# EAGLE design Drone (EAGLE 9.6.2)

## Sheet 1 of 3
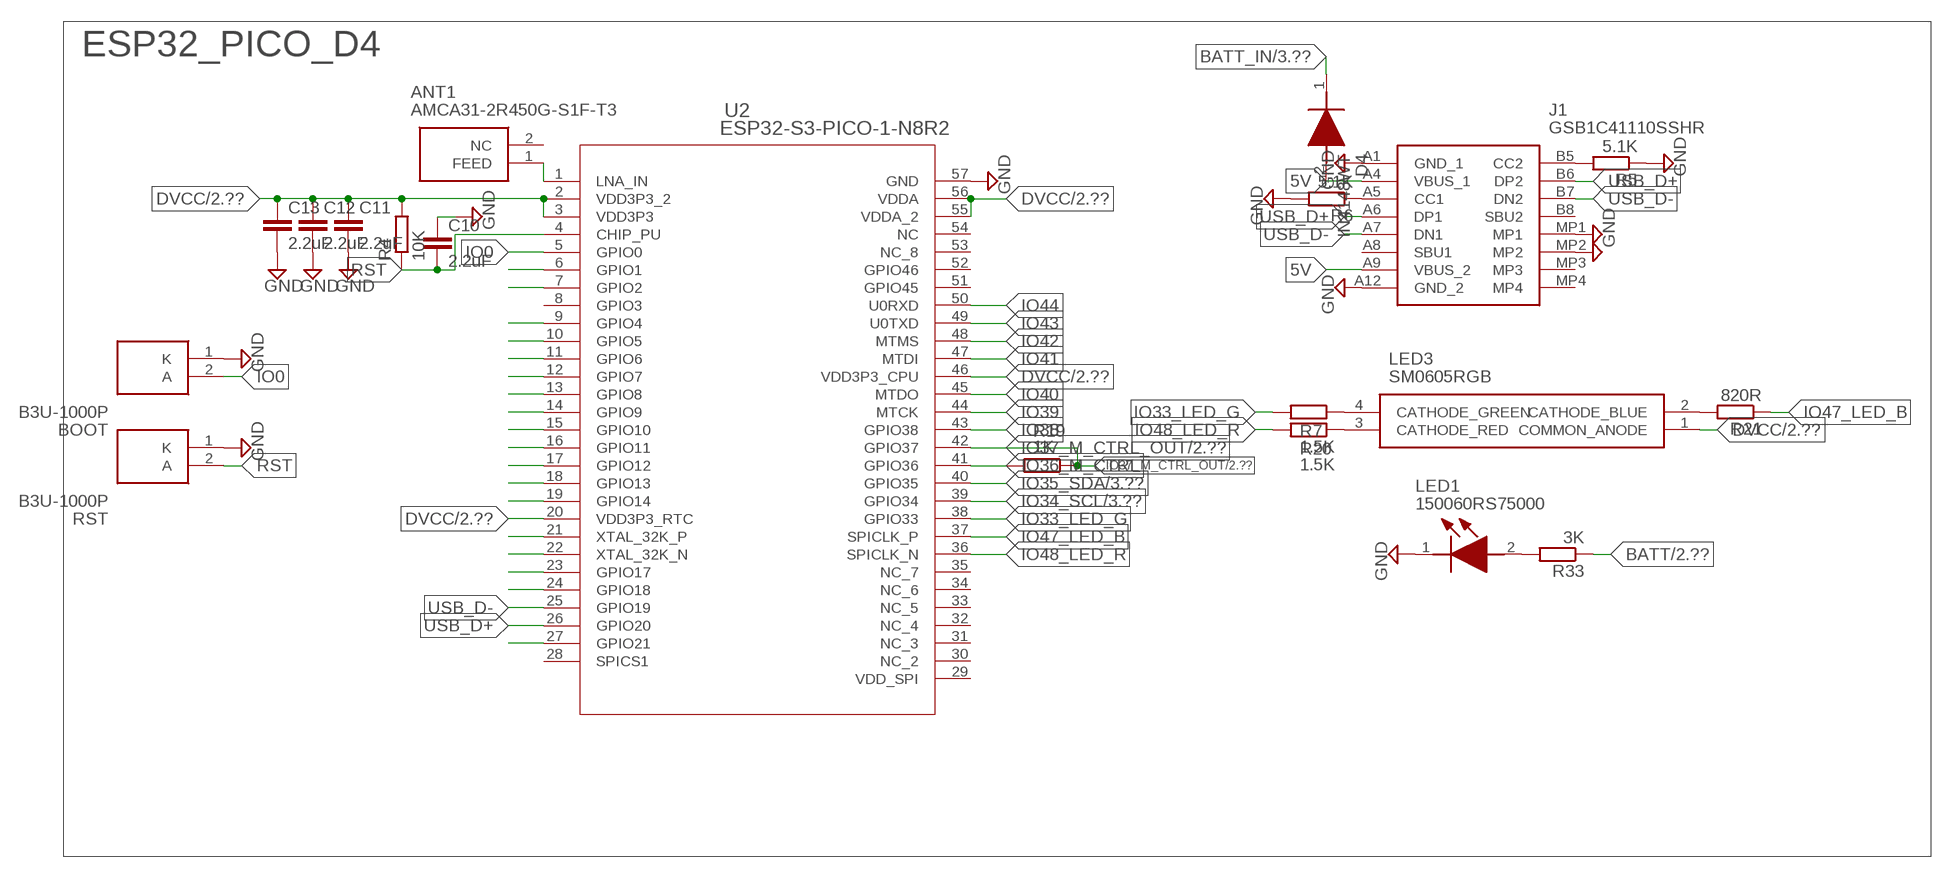
[diagram p0: schematic, sheet 1]

### Parts
ANT1  AMCA31-2R450G-S1F-T3  [ANTC3216X140N]
BOOT  B3U-1000P  [B3U-1000P]
C10  2.2uF  C0402_STANDARD  [C0402_STANDARD]
C11  2.2uF  C0402_STANDARD  [C0402_STANDARD]
C12  2.2uF  C0402_STANDARD  [C0402_STANDARD]
C13  2.2uF  C0402_STANDARD  [C0402_STANDARD]
D4  IN4148WT  [SODFL1608X70N]
J1  GSB1C41110SSHR  [GSB1C41110SSHR]
LED1  150060RS75000  [LEDC1608X80N]
LED3  SM0605RGB  [SM0605RGB]
R4  10K  R0402_STANDARD  [R0402_STANDARD]
R5  5.1K  R0402_STANDARD  [R0402_STANDARD]
R6  5.1K  R0402_STANDARD  [R0402_STANDARD]
R7  1.5K  R0402_STANDARD  [R0402_STANDARD]
R19  1K  R0402_STANDARD  [R0402_STANDARD]
R20  1.5K  R0402_STANDARD  [R0402_STANDARD]
R21  820R  R0402_STANDARD  [R0402_STANDARD]
R33  3K  R0402_STANDARD  [R0402_STANDARD]
RST  B3U-1000P  [B3U-1000P]
U2  ESP32-S3-PICO-1-N8R2  [QFN56_7X7_EXP]

### Nets
5V: D4.2(A) J1.A4(VBUS_1) J1.A9(VBUS_2)
BATT: R33.1 ; also sheet 2,3
BATT_IN: D4.1(K) ; also sheet 3
DVCC: C11.1 C12.1 C13.1 LED3.1(COMMON_ANODE) R4.2 U2.2(VDD3P3_2) U2.3(VDD3P3) U2.20(VDD3P3_RTC) U2.46(VDD3P3_CPU) U2.55(VDDA_2) U2.56(VDDA) ; also sheet 2,3
GND: BOOT.1(K) C10.1 C11.2 C12.2 C13.2 J1.A1(GND_1) J1.A12(GND_2) J1.MP1 J1.MP2 LED1.1(K) R5.1 R6.2 RST.1(K) U2.57(GND) ; also sheet 2,3
IO0: BOOT.2(A) U2.5(GPIO0)
IO33_LED_G: R7.2 U2.38(GPIO33)
IO34_SCL: U2.39(GPIO34) ; also sheet 3
IO35_SDA: U2.40(GPIO35) ; also sheet 3
IO36_M_CTRL: R19.2 U2.41(GPIO36)
IO37_M_CTRL_OUT: R19.1 U2.42(GPIO37) ; also sheet 2
IO38: U2.43(GPIO38)
IO39: U2.44(MTCK)
IO40: U2.45(MTDO)
IO41: U2.47(MTDI)
IO42: U2.48(MTMS)
IO43: U2.49(U0TXD)
IO44: U2.50(U0RXD)
IO47_LED_B: R21.1 U2.37(SPICLK_P)
IO48_LED_R: R20.2 U2.36(SPICLK_N)
N$1: ANT1.1(FEED) U2.1(LNA_IN)
N$4: LED3.4(CATHODE_GREEN) R7.1
N$7: U2.6(GPIO1)
N$8: U2.7(GPIO2)
N$10: U2.9(GPIO4)
N$11: U2.10(GPIO5)
N$12: U2.11(GPIO6)
N$13: U2.12(GPIO7)
N$14: U2.13(GPIO8)
N$15: U2.14(GPIO9)
N$16: U2.15(GPIO10)
N$17: U2.16(GPIO11)
N$18: U2.17(GPIO12)
N$19: U2.18(GPIO13)
N$20: U2.19(GPIO14)
N$21: J1.A5(CC1) R6.1
N$22: U2.21(XTAL_32K_P)
N$23: U2.22(XTAL_32K_N)
N$24: U2.23(GPIO17)
N$25: U2.24(GPIO18)
N$27: LED1.2(A) R33.2
N$28: U2.27(GPIO21)
N$29: LED3.2(CATHODE_BLUE) R21.2
N$32: J1.B5(CC2) R5.2
N$37: LED3.3(CATHODE_RED) R20.1
RST: C10.2 R4.1 RST.2(A) U2.4(CHIP_PU)
USB_D+: J1.A6(DP1) J1.B6(DP2) U2.26(GPIO20)
USB_D-: J1.A7(DN1) J1.B7(DN2) U2.25(GPIO19)
Unconnected: ANT1.2(NC) J1.A8(SBU1) J1.B8(SBU2) J1.MP3 J1.MP4 U2.8(GPIO3) U2.28(SPICS1) U2.30(NC_2) U2.31(NC_3) U2.32(NC_4) U2.33(NC_5) U2.34(NC_6) U2.35(NC_7) U2.51(GPIO45) U2.52(GPIO46) U2.53(NC_8) U2.54(NC)

### Notes on the sheet
- ESP32_PICO_D4

## Sheet 2 of 3
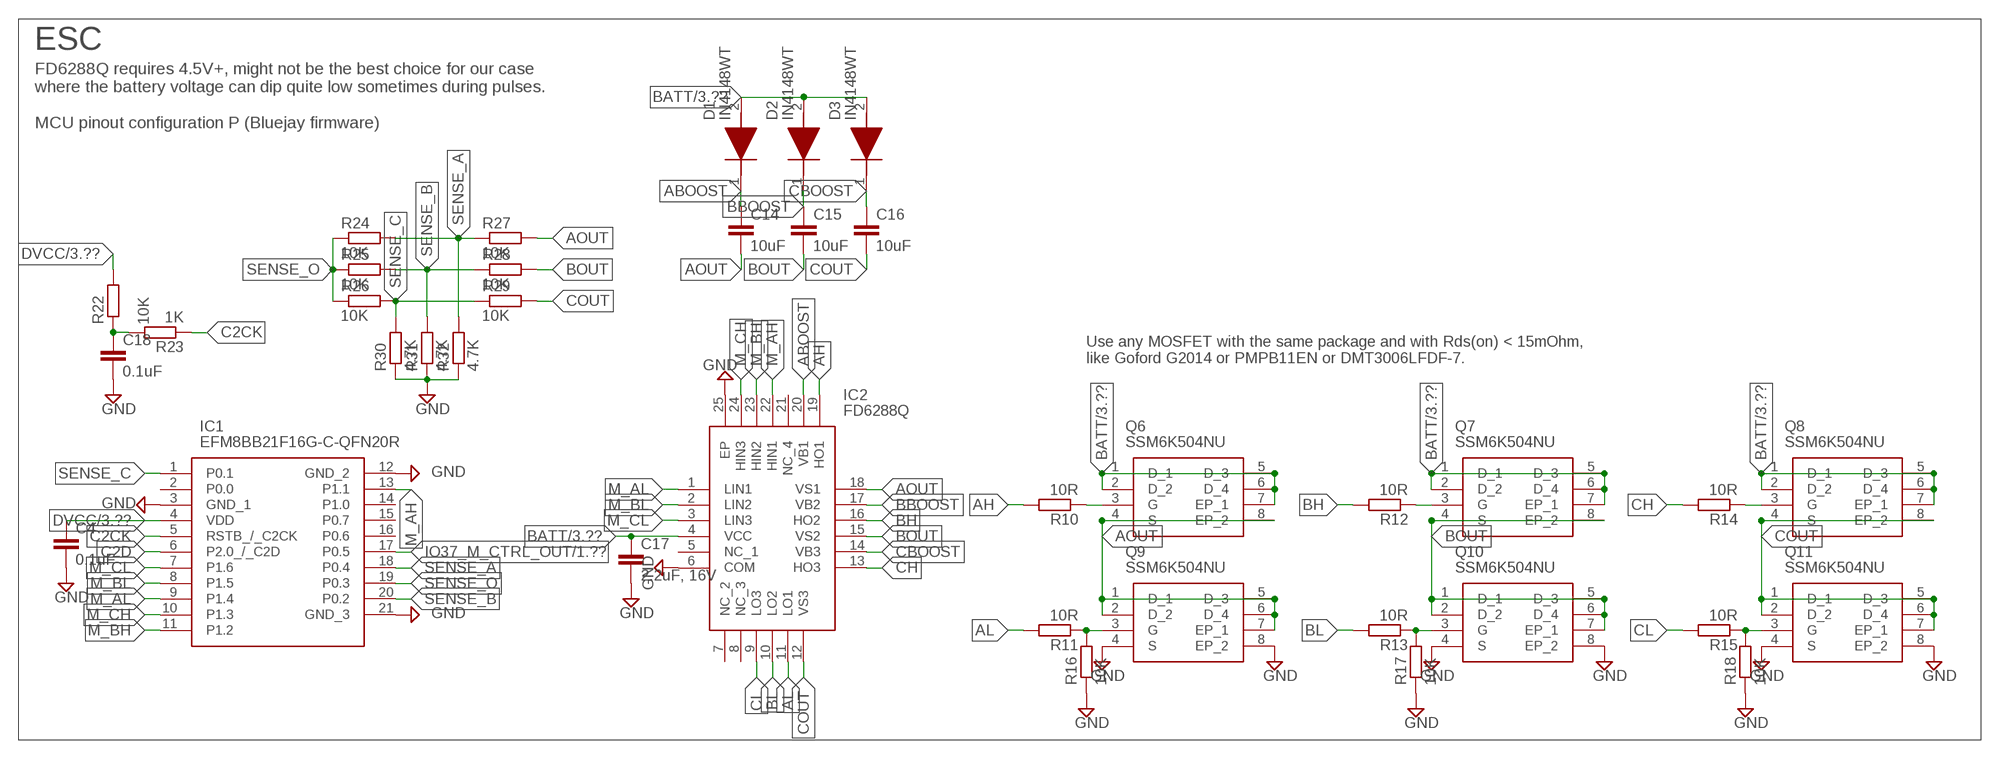
[diagram p1: schematic, sheet 2]

### Parts
C4  0.1uF  C0402_STANDARD  [C0402_STANDARD]
C14  10uF  C0402_STANDARD  [C0402_STANDARD]
C15  10uF  C0402_STANDARD  [C0402_STANDARD]
C16  10uF  C0402_STANDARD  [C0402_STANDARD]
C17  2.2uF, 16V  C0402_STANDARD  [C0402_STANDARD]
C18  0.1uF  C0402_STANDARD  [C0402_STANDARD]
D1  IN4148WT  [SODFL1608X70N]
D2  IN4148WT  [SODFL1608X70N]
D3  IN4148WT  [SODFL1608X70N]
IC1  EFM8BB21F16G-C-QFN20R  [EFM8BB21F16GCQFN20R]
IC2  FD6288Q  [QFN50P400X400X90-25N]
Q6  SSM6K504NU  [SSM6K504NU]
Q7  SSM6K504NU  [SSM6K504NU]
Q8  SSM6K504NU  [SSM6K504NU]
Q9  SSM6K504NU  [SSM6K504NU]
Q10  SSM6K504NU  [SSM6K504NU]
Q11  SSM6K504NU  [SSM6K504NU]
R10  10R  R0402_STANDARD  [R0402_STANDARD]
R11  10R  R0402_STANDARD  [R0402_STANDARD]
R12  10R  R0402_STANDARD  [R0402_STANDARD]
R13  10R  R0402_STANDARD  [R0402_STANDARD]
R14  10R  R0402_STANDARD  [R0402_STANDARD]
R15  10R  R0402_STANDARD  [R0402_STANDARD]
R16  10K  R0402_STANDARD  [R0402_STANDARD]
R17  10K  R0402_STANDARD  [R0402_STANDARD]
R18  10K  R0402_STANDARD  [R0402_STANDARD]
R22  10K  R0402_STANDARD  [R0402_STANDARD]
R23  1K  R0402_STANDARD  [R0402_STANDARD]
R24  10K  R0402_STANDARD  [R0402_STANDARD]
R25  10K  R0402_STANDARD  [R0402_STANDARD]
R26  10K  R0402_STANDARD  [R0402_STANDARD]
R27  10K  R0402_STANDARD  [R0402_STANDARD]
R28  10K  R0402_STANDARD  [R0402_STANDARD]
R29  10K  R0402_STANDARD  [R0402_STANDARD]
R30  4.7K  R0402_STANDARD  [R0402_STANDARD]
R31  4.7K  R0402_STANDARD  [R0402_STANDARD]
R32  4.7K  R0402_STANDARD  [R0402_STANDARD]

### Nets
ABOOST: C14.1 D1.1(K) IC2.20(VB1)
AH: IC2.19(HO1) R10.2
AL: IC2.11(LO1) R11.2
AOUT: C14.2 IC2.18(VS1) Q6.4(S) Q6.8(EP_2) Q9.1(D_1) Q9.2(D_2) Q9.5(D_3) Q9.6(D_4) Q9.7(EP_1) R27.2
BATT: C17.1 D1.2(A) D2.2(A) D3.2(A) IC2.4(VCC) Q6.1(D_1) Q6.2(D_2) Q6.5(D_3) Q6.6(D_4) Q6.7(EP_1) Q7.1(D_1) Q7.2(D_2) Q7.5(D_3) Q7.6(D_4) Q7.7(EP_1) Q8.1(D_1) Q8.2(D_2) Q8.5(D_3) Q8.6(D_4) Q8.7(EP_1) ; also sheet 1,3
BBOOST: C15.1 D2.1(K) IC2.17(VB2)
BH: IC2.16(HO2) R12.2
BL: IC2.10(LO2) R13.2
BOUT: C15.2 IC2.15(VS2) Q7.4(S) Q7.8(EP_2) Q10.1(D_1) Q10.2(D_2) Q10.5(D_3) Q10.6(D_4) Q10.7(EP_1) R28.2
C2CK: IC1.5(RSTB_/_C2CK) R23.1
C2D: IC1.6(P2.0_/_C2D)
CBOOST: C16.1 D3.1(K) IC2.14(VB3)
CH: IC2.13(HO3) R14.2
CL: IC2.9(LO3) R15.2
COUT: C16.2 IC2.12(VS3) Q8.4(S) Q8.8(EP_2) Q11.1(D_1) Q11.2(D_2) Q11.5(D_3) Q11.6(D_4) Q11.7(EP_1) R29.2
DVCC: C4.1 IC1.4(VDD) R22.2 ; also sheet 1,3
GND: C4.2 C17.2 C18.2 IC1.3(GND_1) IC1.12(GND_2) IC1.21(GND_3) IC2.6(COM) IC2.25(EP) Q9.4(S) Q9.8(EP_2) Q10.4(S) Q10.8(EP_2) Q11.4(S) Q11.8(EP_2) R16.1 R17.1 R18.1 R30.1 R31.1 R32.1 ; also sheet 1,3
IO37_M_CTRL_OUT: IC1.17(P0.5) ; also sheet 1
M_AH: IC1.13(P1.1) IC2.22(HIN1)
M_AL: IC1.9(P1.4) IC2.1(LIN1)
M_BH: IC1.11(P1.2) IC2.23(HIN2)
M_BL: IC1.8(P1.5) IC2.2(LIN2)
M_CH: IC1.10(P1.3) IC2.24(HIN3)
M_CL: IC1.7(P1.6) IC2.3(LIN3)
N$31: Q6.3(G) R10.1
N$33: Q9.3(G) R11.1 R16.2
N$34: Q7.3(G) R12.1
N$35: Q10.3(G) R13.1 R17.2
N$36: Q8.3(G) R14.1
N$38: Q11.3(G) R15.1 R18.2
N$55: C18.1 R22.1 R23.2
SENSE_A: IC1.18(P0.4) R24.2 R27.1 R32.2
SENSE_B: IC1.20(P0.2) R25.2 R28.1 R31.2
SENSE_C: IC1.1(P0.1) R26.2 R29.1 R30.2
SENSE_O: IC1.19(P0.3) R24.1 R25.1 R26.1
Unconnected: IC1.2(P0.0) IC1.14(P1.0) IC1.15(P0.7) IC1.16(P0.6) IC2.5(NC_1) IC2.7(NC_2) IC2.8(NC_3) IC2.21(NC_4)

### Notes on the sheet
- ESC
- FD6288Q requires 4.5V+, might not be the best choice for our case
  where the battery voltage can dip quite low sometimes during pulses. 
  
  MCU pinout configuration P (Bluejay firmware)
- Use any MOSFET with the same package and with Rds(on) < 15mOhm,
  like Goford G2014 or PMPB11EN or DMT3006LFDF-7.

## Sheet 3 of 3
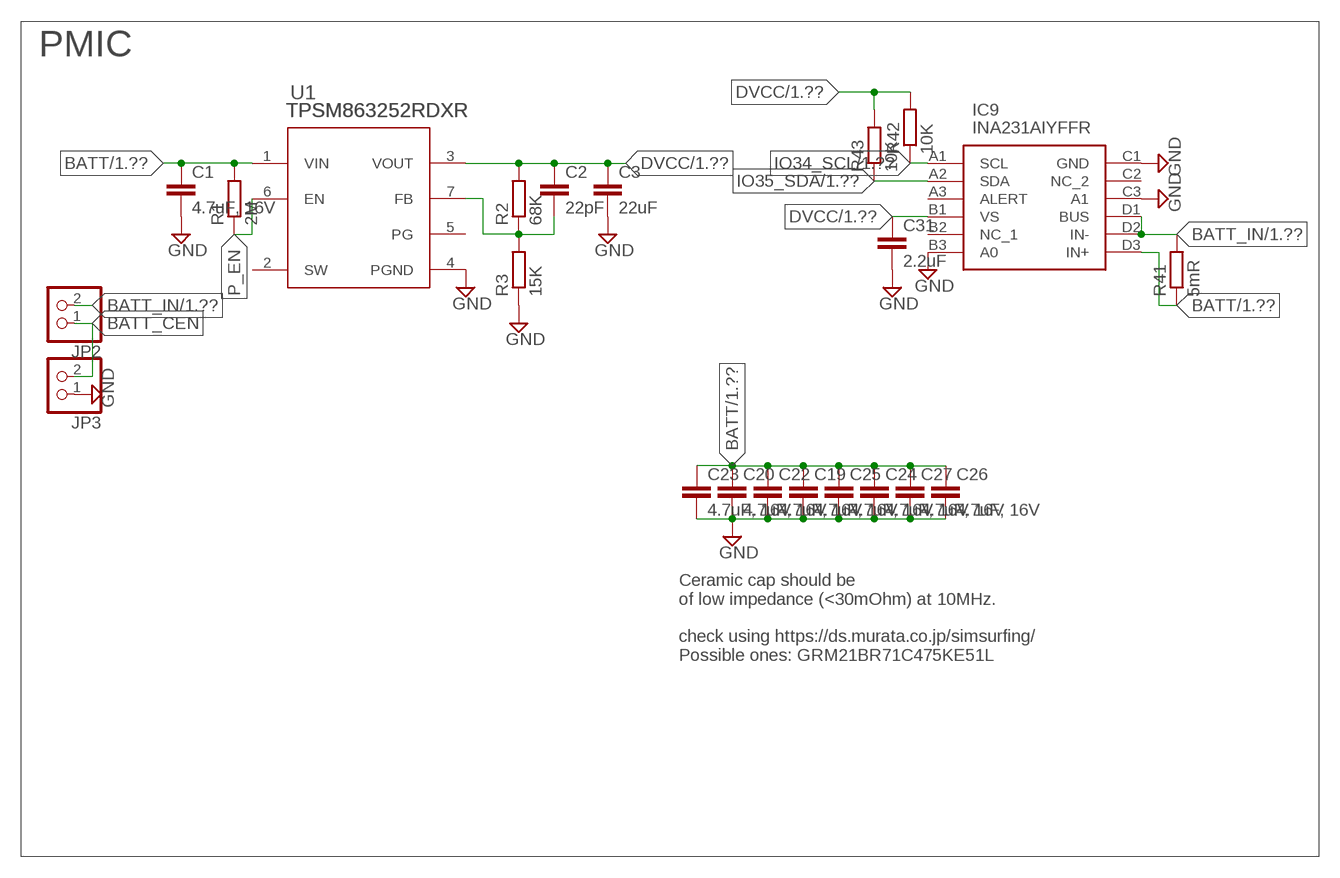
[diagram p2: schematic, sheet 3]

### Parts
C1  4.7uF, 16V  C-EUC0603  [C0603]
C2  22pF  C0402_STANDARD  [C0402_STANDARD]
C3  22uF  C-EUC0603  [C0603]
C19  4.7uF, 16V  C-EUC0805  [C0805]
C20  4.7uF, 16V  C-EUC0805  [C0805]
C22  4.7uF, 16V  C-EUC0805  [C0805]
C23  4.7uF, 16V  C-EUC0805  [C0805]
C24  4.7uF, 16V  C-EUC0805  [C0805]
C25  4.7uF, 16V  C-EUC0805  [C0805]
C26  4.7uF, 16V  C-EUC0805  [C0805]
C27  4.7uF, 16V  C-EUC0805  [C0805]
C31  2.2uF  C0402_STANDARD  [C0402_STANDARD]
IC9  INA231AIYFFR  [BGA12C40P3X4_139X164X62]
JP2  PINHD-1X2  [1X02]
JP3  PINHD-1X2  [1X02]
R1  2M  R0402_STANDARD  [R0402_STANDARD]
R2  68K  R0402_STANDARD  [R0402_STANDARD]
R3  15K  R0402_STANDARD  [R0402_STANDARD]
R41  5mR  R-EU_R0805  [R0805]
R42  10K  R0402_STANDARD  [R0402_STANDARD]
R43  10K  R0402_STANDARD  [R0402_STANDARD]
U1  TPSM863252RDXR  [RDX0007A-MFG]

### Nets
BATT: C1.1 C19.1 C20.1 C22.1 C23.1 C24.1 C25.1 C26.1 C27.1 IC9.D3(IN+) R1.2 R41.1 U1.1(VIN) ; also sheet 1,2
BATT_CEN: JP2.1 JP3.2
BATT_IN: IC9.D1(BUS) IC9.D2(IN-) JP2.2 R41.2 ; also sheet 1
DVCC: C2.1 C3.1 C31.1 IC9.B1(VS) R2.2 R42.2 R43.2 U1.3(VOUT) ; also sheet 1,2
GND: C1.2 C3.2 C19.2 C20.2 C22.2 C23.2 C24.2 C25.2 C26.2 C27.2 C31.2 IC9.B3(A0) IC9.C1(GND) IC9.C3(A1) JP3.1 R3.1 U1.4(PGND) ; also sheet 1,2
IO34_SCL: IC9.A1(SCL) R42.1 ; also sheet 1
IO35_SDA: IC9.A2(SDA) R43.1 ; also sheet 1
N$2: C2.2 R2.1 R3.2 U1.7(FB)
P_EN: R1.1 U1.6(EN)
Unconnected: IC9.A3(ALERT) IC9.B2(NC_1) IC9.C2(NC_2) U1.2(SW) U1.5(PG)

### Notes on the sheet
- PMIC
- Ceramic cap should be
  of low impedance (<30mOhm) at 10MHz.
  
  check using https://ds.murata.co.jp/simsurfing/
  Possible ones: GRM21BR71C475KE51L

## Power pins joined to a net without a drawn wire
VDD_SPI: U2.29(VDD_SPI)

## Library data of the parts
ANT1 = SamacSys_Parts:AMCA31-2R450G-S1F-T3: ABRACON - AMCA31-2R450G-S1F-T3 - ANTENNA, CHIP, 2.45GHZ, 50 OHM, 1206 Source: Datasheet <http://www.abracon.com/chip-antenna/AMCA31-2R450G-S1F-T.pdf>; ARROW_PART_NUMBER: AMCA31-2R450G-S1F-T3; ARROW_PRICE-STOCK: https://www.arrow.com/en/products/amca31-2r450g-s1f-t3/abracon?region=nac; DESCRIPTION: ABRACON - AMCA31-2R450G-S1F-T3 - ANTENNA, CHIP, 2.45GHZ, 50 OHM, 1206; HEIGHT: 1.4mm; MANUFACTURER_NAME: ABRACON; MANUFACTURER_PART_NUMBER: AMCA31-2R450G-S1F-T3; MOUSER_PART_NUMBER: 815-CA312R450GS1FT3; MOUSER_PRICE-STOCK: https://www.mouser.co.uk/ProductDetail/ABRACON/AMCA31-2R450G-S1F-T3?qs=AAveGqk956GLuOddQEK40Q%3D%3D
BOOT RST = SamacSys_Parts:B3U-1000P: OMRON ELECTRONIC COMPONENTS - B3U-1000P - SWITCH, SPST-NO, 0.05A, 12V, SMD Source: Datasheet <https://www.omron.com/ecb/products/pdf/en-b3u.pdf>; ARROW_PART_NUMBER: B3U-1000P; ARROW_PRICE-STOCK: https://www.arrow.com/en/products/b3u1000p/omron?region=europe; DESCRIPTION: OMRON ELECTRONIC COMPONENTS - B3U-1000P - SWITCH, SPST-NO, 0.05A, 12V, SMD; HEIGHT: mm; MANUFACTURER_NAME: Omron Electronics; MANUFACTURER_PART_NUMBER: B3U-1000P; MOUSER_PART_NUMBER: 653-B3U-1000P; MOUSER_PRICE-STOCK: https://www.mouser.co.uk/ProductDetail/Omron-Electronics/B3U-1000P?qs=AO7BQMcsEu4ip80xyf2FwA%3D%3D
C1 C3 C19 C20 C22-C27 = rcl:C-EU: CAPACITOR, European symbol; SPICEPREFIX: C
C2 C4 C10-C18 C31 = Customized_components:C0402_STANDARD
D1-D4 = SamacSys_Parts:IN4148WT: SMD Small Signal Switching Diode Source: Datasheet; DESCRIPTION: SMD Small Signal Switching Diode; HEIGHT: 0.7mm; MANUFACTURER_NAME: Diotec; MANUFACTURER_PART_NUMBER: IN4148WT
IC1 = SamacSys_Parts:EFM8BB21F16G-C-QFN20R: SILICON LABS - EFM8BB21F16G-C-QFN20R - 8 Bit MCU, EFM8 Family EFM8BB Series Microcontrollers, 50 MHz, 16 KB, 2.25 KB, 20 Pins, QFN Source: Datasheet <https://www.silabs.com/documents/public/data-sheets/efm8bb2-datasheet.pdf>; ARROW_PART_NUMBER: EFM8BB21F16G-C-QFN20R; ARROW_PRICE-STOCK: https://www.arrow.com/en/products/efm8bb21f16g-c-qfn20r/silicon-labs?region=nac; DESCRIPTION: SILICON LABS - EFM8BB21F16G-C-QFN20R - 8 Bit MCU, EFM8 Family EFM8BB Series Microcontrollers, 50 MHz, 16 KB, 2.25 KB, 20 Pins, QFN; HEIGHT: 0.8mm; MANUFACTURER_NAME: Silicon Labs; MANUFACTURER_PART_NUMBER: EFM8BB21F16G-C-QFN20R; MOUSER_PART_NUMBER: 634-8BB21F16GCQFN20R; MOUSER_PRICE-STOCK: https://www.mouser.co.uk/ProductDetail/Silicon-Labs/EFM8BB21F16G-C-QFN20R?qs=6viq6gG%252BWEv0H4U5d9AR5A%3D%3D
IC2 = SamacSys_Parts:FD6288Q: QFN-24 MOS Drivers RoHS Source: Datasheet <https://datasheet.lcsc.com/szlcsc/1811131655_Fortior-Tech-FD6288Q_C328453.pdf>; DESCRIPTION: QFN-24 MOS Drivers RoHS; HEIGHT: 0.9mm; MANUFACTURER_NAME: Fortior Tech; MANUFACTURER_PART_NUMBER: FD6288Q
IC9 = SamacSys_Parts:INA231AIYFFR: 28V, Bi-Directional, Low-/High-Side, I2C Out Current/Power Monitor w/Alert in WCSP Source: Datasheet <http://www.ti.com/lit/gpn/INA231>; ARROW_PART_NUMBER: INA231AIYFFR; ARROW_PRICE-STOCK: https://www.arrow.com/en/products/ina231aiyffr/texas-instruments?utm_currency=USD&region=nac; DESCRIPTION: 28V, Bi-Directional, Low-/High-Side, I2C Out Current/Power Monitor w/Alert in WCSP; HEIGHT: 0.625mm; MANUFACTURER_NAME: Texas Instruments; MANUFACTURER_PART_NUMBER: INA231AIYFFR; MOUSER_PART_NUMBER: 595-INA231AIYFFR; MOUSER_PRICE-STOCK: https://www.mouser.co.uk/ProductDetail/Texas-Instruments/INA231AIYFFR?qs=s44pgLhgXQjbCj637LJKHw%3D%3D
J1 = SamacSys_Parts:GSB1C41110SSHR: USB2.0, Type C, Top mount, Center Height 1.63mm, Single Row Surface Mount Source: Datasheet <https://cdn.amphenol-cs.com/media/wysiwyg/files/drawing/gsb1c41x10sshr-ax1.pdf>; DESCRIPTION: USB2.0, Type C, Top mount, Center Height 1.63mm, Single Row Surface Mount; HEIGHT: 3.41mm; MANUFACTURER_NAME: Amphenol Communications Solutions; MANUFACTURER_PART_NUMBER: GSB1C41110SSHR
JP2 JP3 = pinhead:PINHD-1X2: PIN HEADER
LED1 = SamacSys_Parts:150060RS75000: WURTH ELEKTRONIK - 150060RS75000 - LED, 0603, RED, 250MCD, 625NM Source: Datasheet <http://katalog.we-online.de/led/datasheet/150060RS75000.pdf>; DESCRIPTION: WURTH ELEKTRONIK - 150060RS75000 - LED, 0603, RED, 250MCD, 625NM; HEIGHT: 0.8mm; MANUFACTURER_NAME: Wurth Elektronik; MANUFACTURER_PART_NUMBER: 150060RS75000; MOUSER_PART_NUMBER: 710-150060RS75000; MOUSER_PRICE-STOCK: https://www.mouser.co.uk/ProductDetail/Wurth-Elektronik/150060RS75000?qs=LlUlMxKIyB3QnmZ3fw%2FVCA%3D%3D
LED3 = SamacSys_Parts:SM0605RGB: SM0605RGB, Bivar 470 nm, 525 nm, 635 nm 3 RGB LED, 4-Pin 0605 Clear SMD package Source: Datasheet <https://datasheet.datasheetarchive.com/originals/distributors/DKDS-12/224201.pdf>; ARROW_PART_NUMBER: SM0605RGB; ARROW_PRICE-STOCK: https://www.arrow.com/en/products/sm0605rgb/bivar?region=nac; DESCRIPTION: SM0605RGB, Bivar 470 nm, 525 nm, 635 nm 3 RGB LED, 4-Pin 0605 Clear SMD package; HEIGHT: 0.6mm; MANUFACTURER_NAME: Bivar; MANUFACTURER_PART_NUMBER: SM0605RGB; MOUSER_PART_NUMBER: 749-SM0605TCRGB; MOUSER_PRICE-STOCK: https://www.mouser.co.uk/ProductDetail/Bivar/SM0605RGB?qs=pfd5qewlna4PrJ6da7Zedg%3D%3D
Q6-Q11 = SamacSys_Parts:SSM6K504NU: Small Low ON resistance MOSFETs Source: Datasheet <http://toshiba.semicon-storage.com/info/docget.jsp?did=13720&prodName=SSM6K504NU>; DESCRIPTION: Small Low ON resistance MOSFETs; HEIGHT: 0.8mm; MANUFACTURER_NAME: Toshiba; MANUFACTURER_PART_NUMBER: SSM6K504NU; MOUSER_PART_NUMBER: N/A; MOUSER_PRICE-STOCK: https://www.mouser.co.uk/ProductDetail/Toshiba/SSM6K504NU?qs=TCEIJQ6oZHxcnwqdmxHSFw%3D%3D
R1-R7 R10-R33 R42 R43 = Customized_components:R0402_STANDARD
R41 = rcl:R-EU_: RESISTOR, European symbol; SPICEPREFIX: R
U1 = SamacSys_Parts:TPSM863252RDXR; COPYRIGHT: Copyright (C) 2024 Ultra Librarian. All rights reserved.; MANUFACTURER_PART_NUMBER: TPSM863252RDXR; MFR_NAME: Texas Instruments; REFDES: RefDes; TYPE: TYPE
U2 = SamacSys_Parts:ESP32-S3-PICO-1-N8R2; COPYRIGHT: Copyright (C) 2024 Ultra Librarian. All rights reserved.; MANUFACTURER_PART_NUMBER: ESP32-S3-PICO-1-N8R2; MFR_NAME: Espressif Systems

## Module PD_AMP
Ports: 

### Library data of the parts

## Board
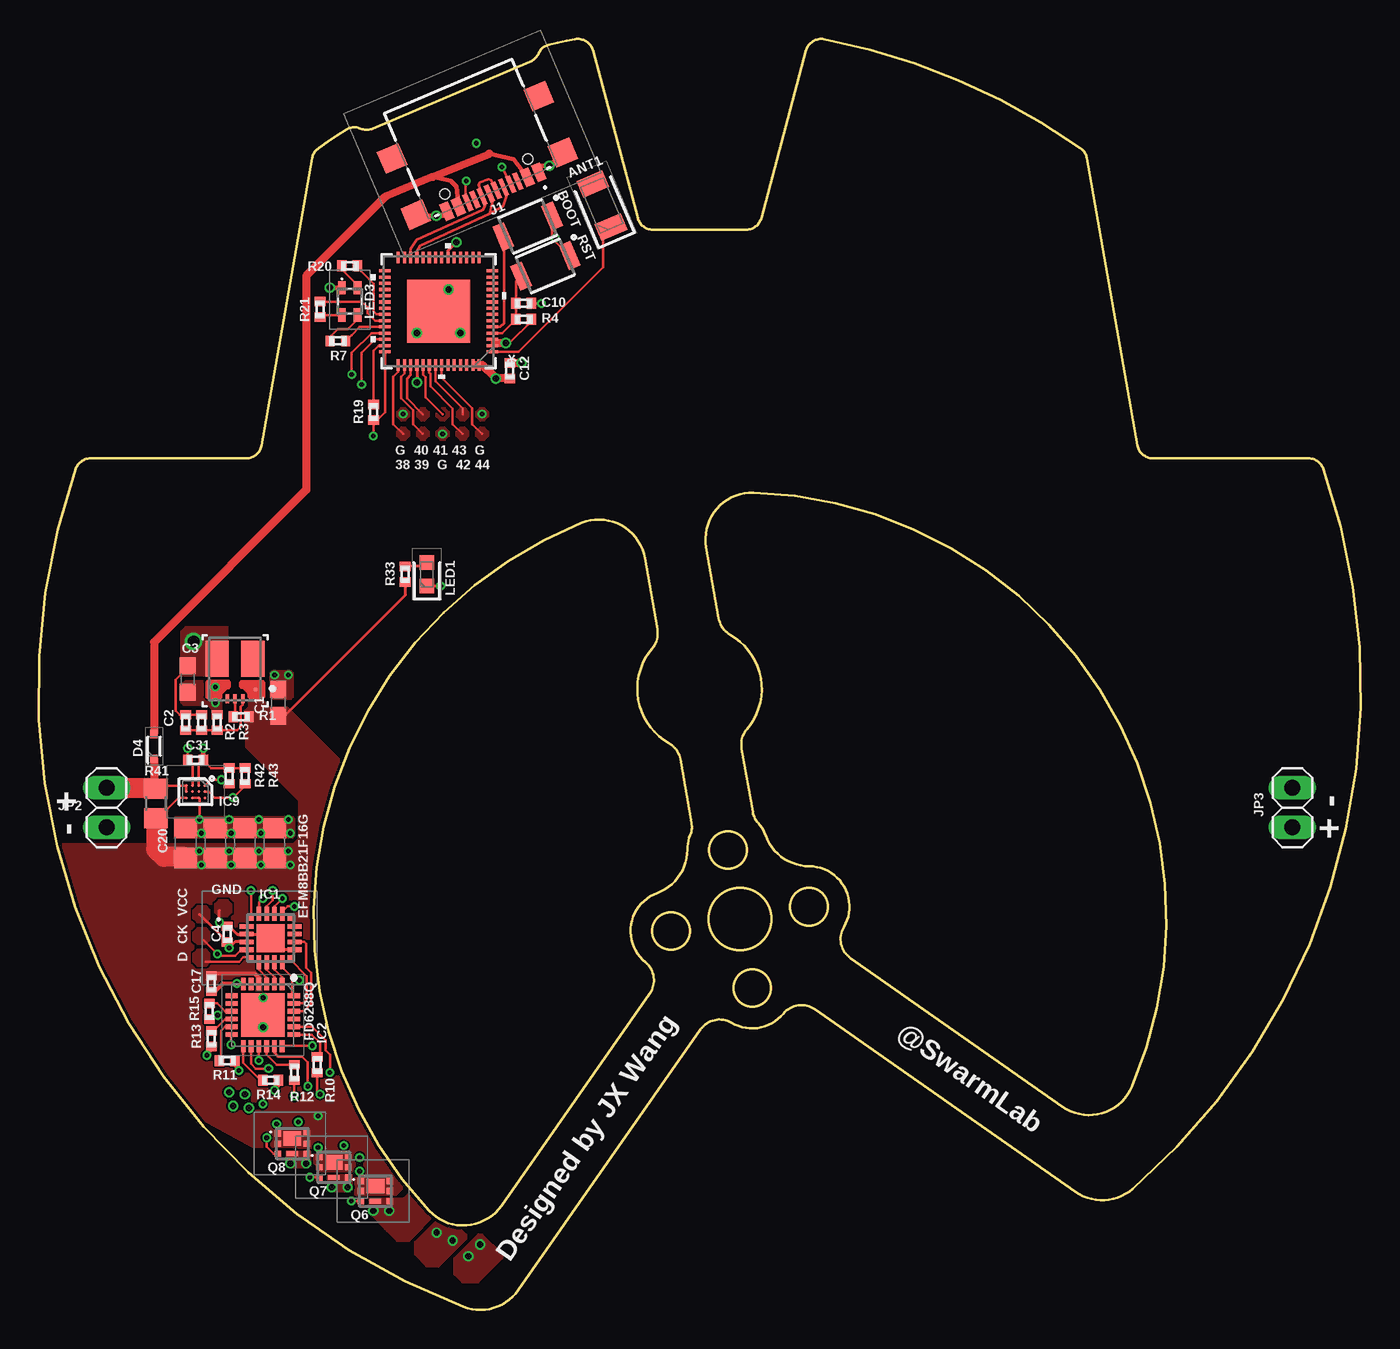
[diagram p3: board, top side]
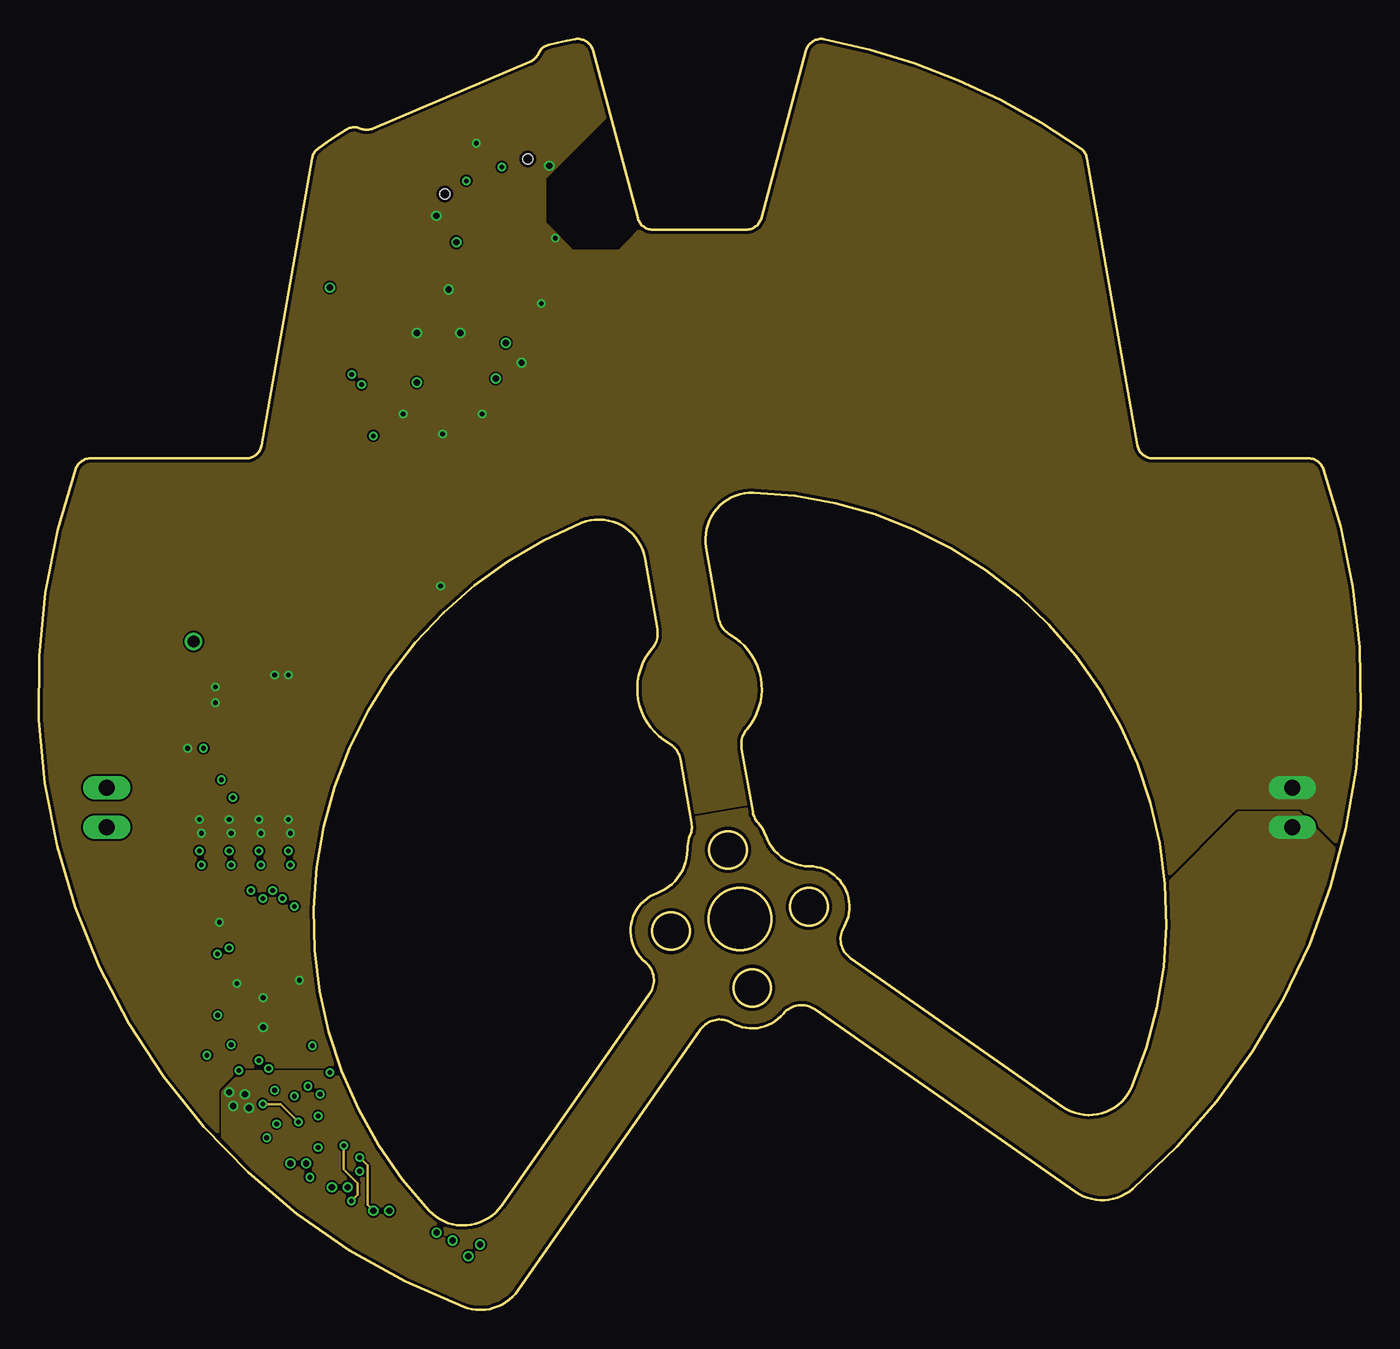
[diagram p4: board, inner layer Route2]
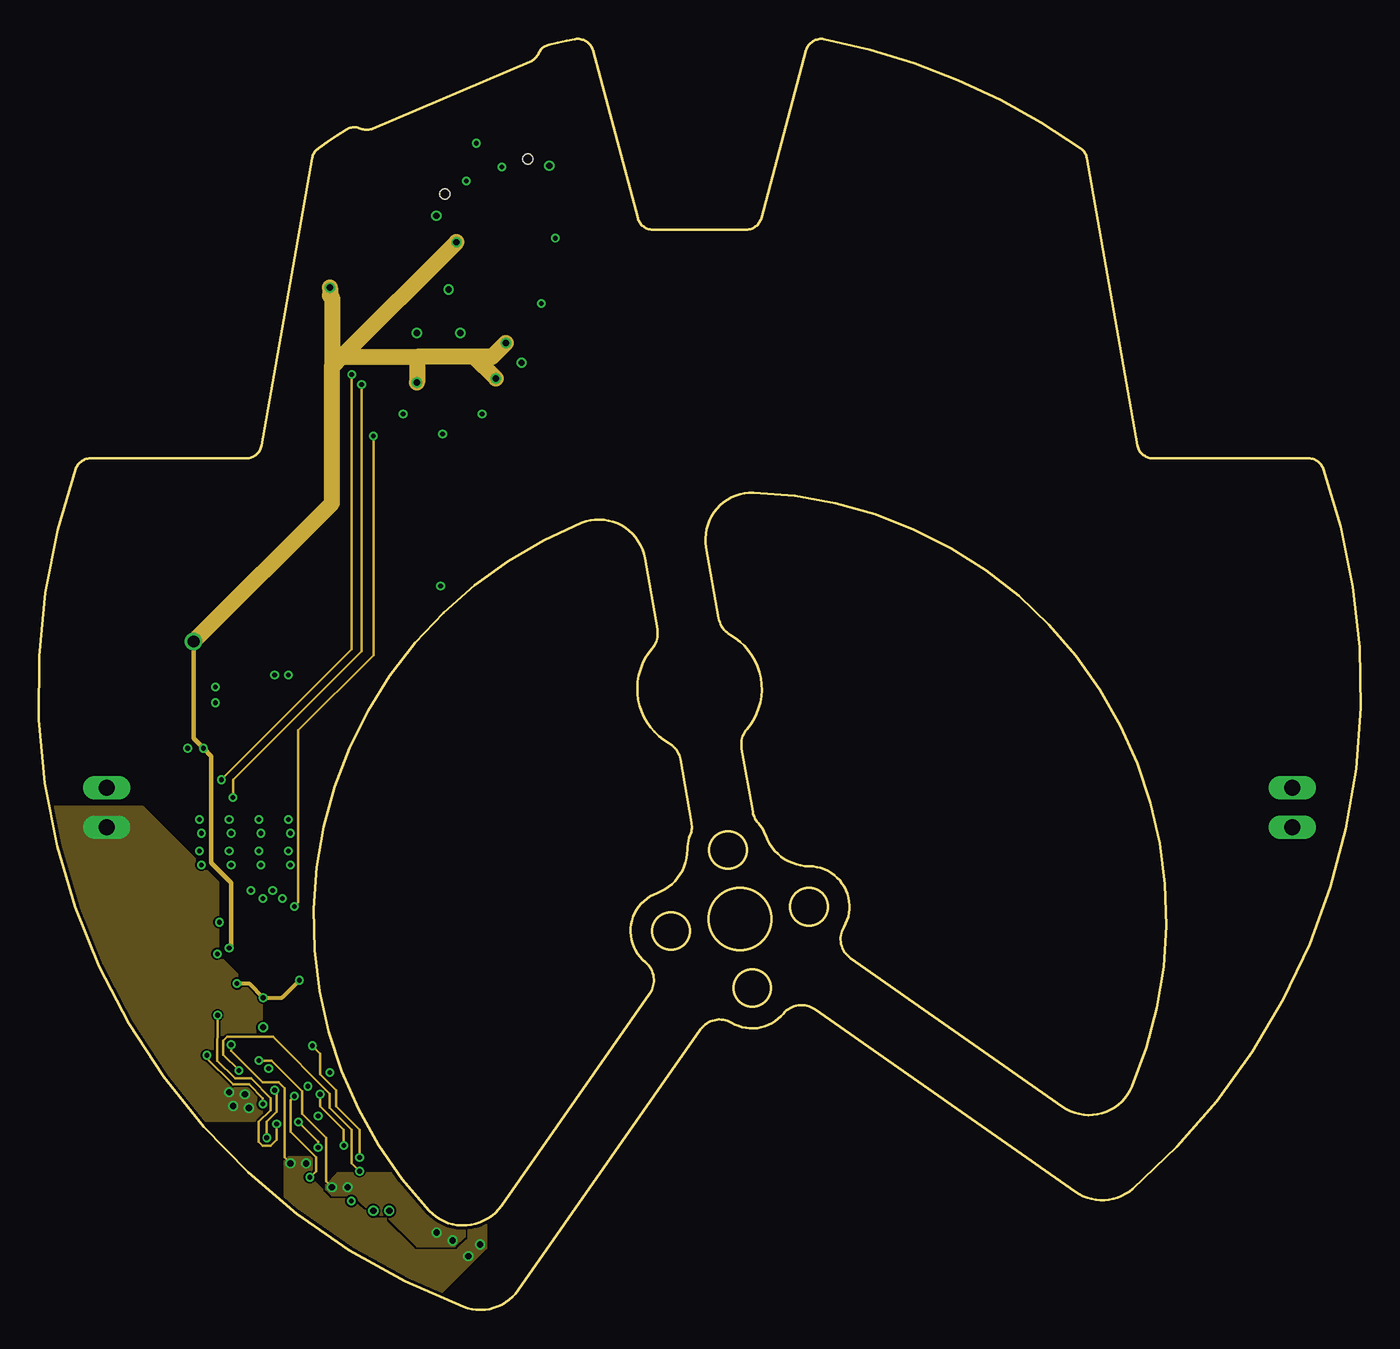
[diagram p5: board, inner layer Route15]
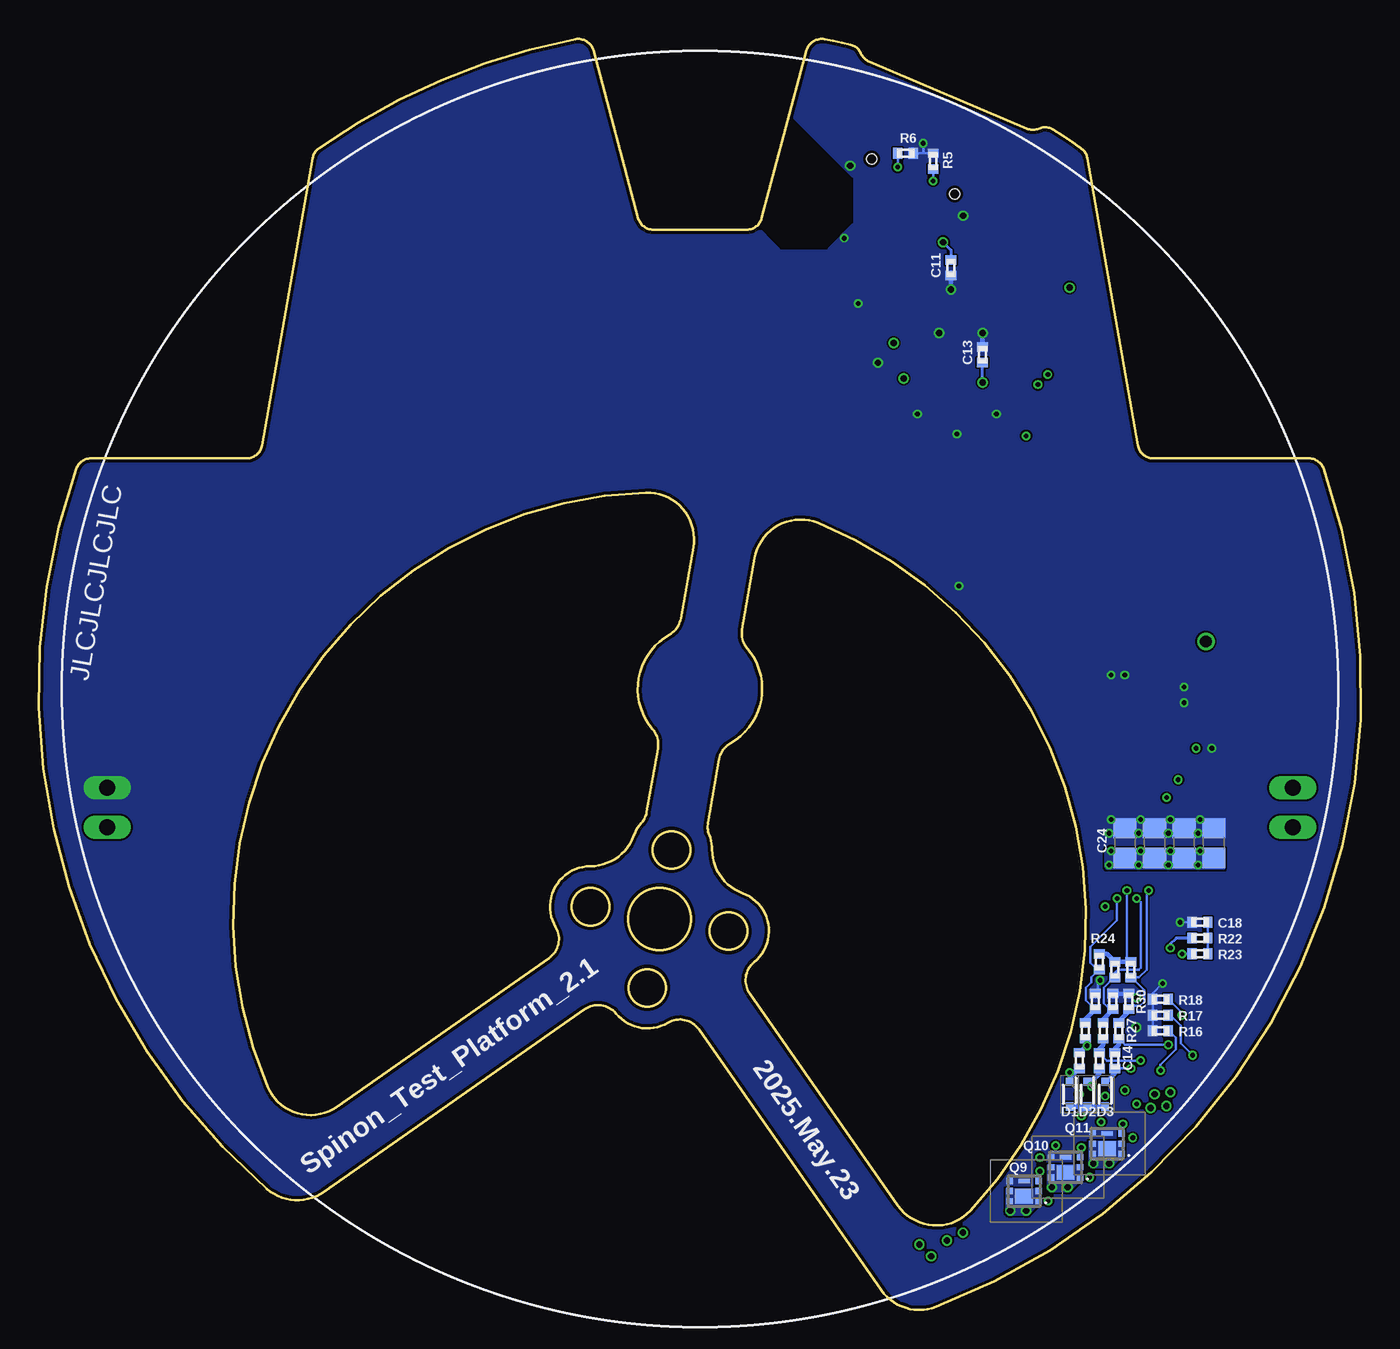
[diagram p6: board, bottom side, seen from below]

Size 84.94 x 81.65 mm. Coordinates in mm from the lower left corner, seen from the top.
Outline: 38.94,48.29 arc102 34.87,50.56 arc111 25.08,6.37 arc102 29.72,6.71 39.25,20.31 arc86 38.97,22.33 arc-120 39.72,26.78 arc69 41.68,29.57 arc-21 41.86,30.5 arc31 41.94,31.31 41.22,35.37 arc50 40.48,36.41 arc-101 39.41,42.49 arc50 39.75,43.73 38.94,48.29
Outline: 51.73,24.58 arc86 52.16,22.59 65.77,13.06 arc102 70.25,14.34 arc111 45.93,52.51 arc102 42.88,48.99 43.69,44.42 arc50 44.42,43.38 arc-101 45.5,37.3 arc50 45.16,36.06 45.88,32 arc31 46.23,31.27 arc-21 46.71,30.46 arc69 49.51,28.5 arc-120 51.73,24.58
Outline: 38.49,70.14 35.6,80.91 arc86 34.45,81.63 arc2 32.79,81.28 arc53 32.1,80.71 arc-43 31.58,80.19 21.45,75.89 arc-46 20.67,75.89 arc55 19.75,75.82 arc3 17.97,74.63 arc45 17.56,73.99 14.31,55.54 arc-80 13.32,54.71 3.32,54.71 arc71 2.38,54.04 arc89 27.28,0.2 arc76 30.8,1.28 42.53,18.02 arc-86 44.52,18.45 arc81 47.85,19.04 arc-86 49.87,19.31 66.61,7.59 arc76 70.29,7.78 arc69 82.53,54.04 arc71 81.59,54.71 71.59,54.71 arc-80 70.6,55.54 67.35,73.99 arc45 66.94,74.63 arc24 50.46,81.63 arc86 49.31,80.91 46.42,70.14 arc-75 45.45,69.39 39.45,69.39 arc-75 38.49,70.14
Outline: circle at 49.49,25.9 radius 1.2
Outline: circle at 44.28,29.55 radius 1.2
Outline: circle at 45.06,25.12 radius 2
Outline: circle at 40.63,24.34 radius 1.2
Outline: circle at 45.84,20.69 radius 1.2
Copper layers (1*2*15*16): Top 0.035559375mm / dielectric 0.17018125mm / Route2 0.01778125mm / dielectric 0.4mm / Route15 0.01778125mm / dielectric 0.17018125mm / Bottom 0.035559375mm
Design rules "JLC_4_1oz": minimum track width 0.1mm, minimum drill 0.2mm, track to track 0.115mm, track to pad 0.115mm, pad to pad 0.115mm, via to via 0.115mm, smd to smd 0mil, copper to edge 0.2mm, drill to drill 0.5mm, minimum pad ring 5mil, minimum via ring 5mil, stop-mask expansion 0.05mm, vias tented up to drill 100mil, thermal gap 10mil
Holes 0.65 mm at 31.41,73.95 26.09,71.69 26.09,71.69 31.41,73.95 26.09,71.69 26.09,71.69 31.41,73.95 31.41,73.95 26.09,71.69 26.09,71.69 31.41,73.95 31.41,73.95 26.09,71.69 26.09,71.69 31.41,73.95 31.41,73.95 26.09,71.69 26.09,71.69 31.41,73.95 31.41,73.95 26.09,71.69 26.09,71.69 31.41,73.95 31.41,73.95

### Footprints (pad centres in the part's own frame; a part is rotated, then mirrored left to right if it is on the bottom)
ANTC3216X140N = smd 1.15 x 1.8: 1 -1.5,0; 2 1.5,0
B3U-1000P = smd 0.8 x 1.7: 1 1.7,0; 2 -1.7,0
C0603 = smd 1.1 x 1: 1 -0.85,0; 2 0.85,0
C0402_STANDARD = smd 0.6 x 0.7: 1 -0.5,0; 2 0.5,0
C0805 = smd 1.3 x 1.5: 1 -0.95,0; 2 0.95,0
SODFL1608X70N = smd 0.54 x 0.49: 1 -0.8,0; 2 0.8,0
EFM8BB21F16GCQFN20R = smd 0.3 x 0.3: 1 -1.25,1.25; 6 -1.25,-1.25; 11 1.25,-1.25; 16 1.25,1.25 | smd 0.9 x 0.3: 2 -1.55,0.75; 3 -1.55,0.25; 4 -1.55,-0.25; 5 -1.55,-0.75; 12 1.55,-0.75; 13 1.55,-0.25; 14 1.55,0.25; 15 1.55,0.75 | smd 0.3 x 0.9: 7 -0.75,-1.55; 8 -0.25,-1.55; 9 0.25,-1.55; 10 0.75,-1.55; 17 0.75,1.55; 18 0.25,1.55; 19 -0.25,1.55; 20 -0.75,1.55 | smd 1.8 x 1.8: 21 0,0
QFN50P400X400X90-25N = smd 0.8 x 0.3: 1 -2,1.25; 2 -2,0.75; 3 -2,0.25; 4 -2,-0.25; 5 -2,-0.75; 6 -2,-1.25; 13 2,-1.25; 14 2,-0.75; 15 2,-0.25; 16 2,0.25; 17 2,0.75; 18 2,1.25 | smd 0.3 x 0.8: 7 -1.25,-2; 8 -0.75,-2; 9 -0.25,-2; 10 0.25,-2; 11 0.75,-2; 12 1.25,-2; 19 1.25,2; 20 0.75,2; 21 0.25,2; 22 -0.25,2; 23 -0.75,2; 24 -1.25,2 | smd 2.8 x 2.8: 25 0,0
BGA12C40P3X4_139X164X62 = smd 0.2 x 0.2: A1 -0.4,0.6; A2 0,0.6; A3 0.4,0.6; B1 -0.4,0.2; B2 0,0.2; B3 0.4,0.2; C1 -0.4,-0.2; C2 0,-0.2; C3 0.4,-0.2; D1 -0.4,-0.6; D2 0,-0.6; D3 0.4,-0.6
GSB1C41110SSHR = smd 0.6 x 1.15: A1 -3.2,3.39; A4 -2.4,3.39; A9 2.4,3.39; A12 3.2,3.39 | smd 0.3 x 1.15: A5 -1.25,3.39; A6 -0.25,3.39; A7 0.25,3.39; A8 1.25,3.39; B5 1.75,3.39; B6 0.75,3.39; B7 -0.75,3.39; B8 -1.75,3.39 | smd 1.5 x 1.5: MP1 -5.12,2.815; MP2 5.12,2.815; MP3 -5.12,-1.115; MP4 5.12,-1.115 | hole 0.65: -2.89,2.315; 2.89,2.315
1X02 = drill 1.016 long: 1 -1.27,0; 2 1.27,0
LEDC1608X80N = smd 0.95 x 0.95: 1 -0.75,0; 2 0.75,0
SM0605RGB = smd 0.5 x 0.85: 1 0.5,-0.875; 2 0.5,0.875; 3 -0.5,-0.875; 4 -0.5,0.875
SSM6K504NU = smd 0.4 x 0.425: 1 -0.65,-0.938; 2 0,-0.938; 3 0.65,-0.938; 4 0.65,0.938; 5 0,0.938; 6 -0.65,0.938 | smd 0.95 x 1.15: 7 -0.325,0 | smd 0.3 x 0.75: 8 0.65,0
R0402_STANDARD = smd 0.6 x 0.7: 1 -0.5,0; 2 0.5,0
R0805 = smd 1.3 x 1.5: 1 -0.95,0; 2 0.95,0
RDX0007A-MFG = smd 0.254 x 0.254: 1 -1.312,1.312; 4 1.281,1.276 | smd 1.5 x 2.3: 2 -1.15,-0.675; 3 1.15,-0.675 | smd 0.22 x 0.6: 5 0.5,1.9; 6 0,1.9; 7 -0.5,1.9
QFN56_7X7_EXP = smd 0.755 x 0.199: 1 -3.452,2.6; 2 -3.452,2.2; 3 -3.452,1.8; 4 -3.452,1.4; 5 -3.452,1; 6 -3.452,0.6; 7 -3.452,0.2; 8 -3.452,-0.2; 9 -3.452,-0.6; 10 -3.452,-1; 11 -3.452,-1.4; 12 -3.452,-1.8; 13 -3.452,-2.2; 14 -3.452,-2.6; 29 3.452,-2.6; 30 3.452,-2.2; 31 3.452,-1.8; 32 3.452,-1.4; 33 3.452,-1; 34 3.452,-0.6; 35 3.452,-0.2; 36 3.452,0.2; 37 3.452,0.6; 38 3.452,1; 39 3.452,1.4; 40 3.452,1.8; 41 3.452,2.2; 42 3.452,2.6 | smd 0.199 x 0.755: 15 -2.6,-3.452; 16 -2.2,-3.452; 17 -1.8,-3.452; 18 -1.4,-3.452; 19 -1,-3.452; 20 -0.6,-3.452; 21 -0.2,-3.452; 22 0.2,-3.452; 23 0.6,-3.452; 24 1,-3.452; 25 1.4,-3.452; 26 1.8,-3.452; 27 2.2,-3.452; 28 2.6,-3.452; 43 2.6,3.452; 44 2.2,3.452; 45 1.8,3.452; 46 1.4,3.452; 47 1,3.452; 48 0.6,3.452; 49 0.2,3.452; 50 -0.2,3.452; 51 -0.6,3.452; 52 -1,3.452; 53 -1.4,3.452; 54 -1.8,3.452; 55 -2.2,3.452; 56 -2.6,3.452 | smd 4.039 x 4.039: 57 0,0

### Placement (x,y rotation side)
ANT1  36.18,70.96 113 top
BOOT  31.4,69.61 23 top
C1  15.4,39.01 90 top
C2  9.43,37.74 270 top
C3  9.56,40.53 270 top
C4  12.1,24.15 90 top
C10  31.15,64.66 180 top
C11  26.32,66.95 270 bottom
C12  30.26,60.34 90 top
C13  24.29,61.36 90 bottom
C14  18.07,16.02 90 bottom
C15  16.8,16.02 90 bottom
C16  15.78,16.02 90 bottom
C17  11.08,20.97 270 top
C18  10.32,24.91 180 bottom
C19  11.34,29.99 90 top
C20  9.43,29.99 90 top
C22  13.24,29.99 90 top
C23  15.15,29.99 90 top
C24  15.15,29.99 90 bottom
C25  9.43,29.99 90 bottom
C26  11.34,29.99 90 bottom
C27  13.24,29.99 90 bottom
C31  10.07,35.32 180 top
D1  18.7,13.86 270 bottom
D2  17.56,13.86 270 bottom
D3  16.42,13.86 270 bottom
D4  7.4,36.21 90 top
IC1  14.89,23.89 0 top
IC2  14.39,18.94 270 top
IC9  10.07,33.29 270 top
J1  27.85,74.95 203 top
JP2  4.35,32.27 90 top
JP3  80.55,32.27 270 top
LED1  24.93,47.26 90 top
LED3  19.97,64.79 180 top
Q6  21.63,7.64 270 top
Q7  18.96,9.16 270 top
Q8  16.29,10.68 270 top
Q9  21.63,7.64 90 bottom
Q10  18.96,9.16 90 bottom
Q11  16.29,10.68 90 bottom
R1  12.99,38.12 0 top
R2  10.45,37.74 90 top
R3  11.47,37.74 270 top
R4  31.15,63.64 0 top
R5  27.47,73.8 270 bottom
R6  29.25,74.31 0 bottom
R7  19.21,62.25 0 top
R10  17.89,15.74 90 top
R11  12.1,16.02 180 top
R12  16.42,15.26 90 top
R13  11.08,17.42 90 top
R14  14.89,14.75 180 top
R15  10.96,19.19 90 top
R16  12.86,17.92 0 bottom
R17  12.86,18.94 0 bottom
R18  12.86,19.96 0 bottom
R19  21.5,57.67 90 top
R20  19.97,67.07 0 top
R21  18.07,64.28 270 top
R22  10.32,23.89 180 bottom
R23  10.32,22.88 0 bottom
R24  16.8,22.37 270 bottom
R25  15.78,21.86 270 bottom
R26  14.77,21.86 270 bottom
R27  17.69,17.92 270 bottom
R28  16.55,17.92 270 bottom
R29  15.53,17.92 270 bottom
R30  14.89,19.83 270 bottom
R31  15.91,19.83 270 bottom
R32  17.05,19.83 270 bottom
R33  23.53,47.26 90 top
R41  7.53,32.53 90 top
R42  12.23,34.31 90 top
R43  13.24,34.31 90 top
RST  32.55,67.07 23 top
U1  12.61,41.16 180 top
U2  25.69,64.15 180 top

### Tracks (layer width: path | path; a pad name or v marks a point on that pad's centre or on a via)
5V
  Top 0.305: J1.A4 31.38,72.8 30.51,73.92 28.95,74.29 | J1.A9 26.83,72.15 26.45,72.53 25.31,72.79
  Top 0.508: 28.95,74.29 25.31,72.79 22.26,71.51 17.18,66.43 17.18,52.68 7.4,42.9 D4.2
ABOOST  (via drill 0.3)
  Top 0.152: v18.7,15.26 18.7,16.4 18.41,16.69 18.41,17.33 17.55,18.19 IC2.20
  Bottom 0.152: D1.1 v18.7,15.26
  Bottom 0.305: D1.1 18.7,14.88 C14.1
AH
  Top 0.152: IC2.19 17.54,17.69 18.07,17.16 18.07,16.39 17.92,16.24 R10.2
AL
  Top 0.152: IC2.11 11.99,18.19 11.73,17.93 11.73,16.15 R11.2
AOUT  (via drill 0.3, 0.4)
  Top 0.152: v17.56,16.97 15.67,16.97 IC2.18
  Route2 0.152: v20.61,9.8 21.12,9.29 21.12,6.75 v21.5,6.37
  Route15 0.152: v17.56,16.97 18.07,16.46 18.07,15.13 19.09,14.11 19.09,13.1 20.61,11.57 v20.61,9.8
  Bottom 0.152: v17.56,16.97 17.62,16.97 C14.2
  Bottom 0.305: R27.2 17.69,16.92 18.07,16.53 C14.2
  other vias: 22.51,6.37
  pour Top (no thermals): 24.29,7.76 24.04,7.76 22.26,5.99 22.26,5.22 23.02,4.46 23.78,4.46 25.56,6.24 25.56,6.49
  pour Top (rank 2, no thermals): 21.24,7.13 21.24,6.24 22.39,5.1 22.64,5.1 23.4,5.86 23.4,7.13
  pour Bottom (no thermals): 20.61,7.76 22.77,7.76 22.77,6.24 22.64,6.11 21.37,6.11 20.61,6.87
BATT  (via drill 0.3)
  Top 0.152: R41.1 7.66,31.58 8.97,32.89 IC9.D3
  Top 0.203: R33.1 23.53,45.9 15.78,38.16 C1.1
  Top 0.254: IC2.4 14.14,21.35 13.88,21.61 11.22,21.61 C17.1
  Top 1.27: C25.1 9.37,29.1 8.04,29.1 7.53,29.61 R41.1
  Bottom 0.305: D3.2 D2.2 | D2.2 D1.2 | v17.94,12.46 17.94,12.93 17.82,13.06 D2.2
  other vias: 10.32,29.48 10.45,28.59 12.23,29.48 12.35,28.59 14.13,29.48 14.26,28.59 16.04,29.48 16.16,28.59
  pour Top (no thermals): 14.44,40.28 14.44,39.11 14.92,38.62 15.78,38.62 15.78,37.74 13.24,37.74 13.24,38.5 13.5,38.75 13.5,40.28
  pour Top (rank 6, no thermals): -0.47,28.21 1.18,29.86 16.42,29.86 16.8,30.24 16.8,32.78 13.37,36.21 13.37,38.12 13.88,38.62 15.91,38.62 22.34,32.19 22.34,29.86 23.81,28.4 23.81,8.4 22.79,7.38 18.07,7.38 18.07,9.16 16.67,10.56 13.8,10.56 -0.47,18.33
  pour Bottom (rank 2, no thermals): 8.8,29.61 16.29,29.61 16.42,29.48 16.42,28.46 16.29,28.34 8.8,28.34
BATT_CEN  (via drill 0.4)
  other vias: 13.24,13.86 13.5,12.97 12.48,13.1 12.23,13.99
  pour Route2 (rank 5, no thermals): 11.85,8.27 11.85,13.99 13.12,15.26 21.63,15.26 37.07,30.7 48.13,32.63 72.41,27.18 77.12,31.89 80.93,31.89 84.49,28.34 84.49,-19.67 39.79,-19.67
  pour Route15 (rank 5, no thermals): -1.62,30.12 0.54,32.27 6.64,32.27 11.47,27.45 11.47,22.75 14.26,19.96 14.26,12.21 -1.62,12.21
BATT_IN
  Top 0.152: R41.2 7.74,33.69 IC9.D1 IC9.D2
  Top 0.508: D4.1 7.4,33.61 R41.2
  Top 1.27: JP2.2 7.46,33.54 R41.2
BBOOST  (via drill 0.3)
  Top 0.152: v17.28,14.37 17.28,15.92 16.93,16.27 15.38,16.27 15.14,16.51 IC2.17
  Bottom 0.152: D2.1 17.56,14.65 v17.28,14.37
  Bottom 0.305: D2.1 17.33,14.66 16.8,15.19 C15.1
BH
  Top 0.152: IC2.16 14.64,16.4 15.28,15.76 R12.2
BL
  Top 0.152: IC2.10 11.97,18.69 11.2,17.92 R13.2
BOUT  (via drill 0.3, 0.4)
  Top 0.152: v14.13,16.02 IC2.15
  Route15 0.152: v18.83,7.89 18.45,8.27 18.45,11.07 16.93,12.59 16.93,14.06 14.97,16.02 v14.13,16.02
  Bottom 0.152: C15.2 16.3,16.02 v14.13,16.02
  Bottom 0.305: R28.2 16.55,17.04 16.8,16.79 C15.2
  other vias: 19.85,7.89 25.56,4.97 26.58,4.46
  pour Top (no thermals): 26.2,6.11 25.94,6.11 24.17,4.33 24.17,3.57 24.93,2.81 25.69,2.81 27.47,4.59 27.47,4.84
  pour Top (no thermals): 18.58,8.65 18.58,7.76 18.7,7.64 19.97,7.64 20.1,7.76 20.1,8.65
  pour Bottom (no thermals): 17.94,9.29 20.1,9.29 20.1,7.76 19.97,7.64 18.7,7.64 17.94,8.4
  pour Route15: 19.21,8.78 24.55,8.78 27.34,5.99 27.34,4.72 26.71,4.08 24.29,4.08 22.26,6.11 21.5,6.11 20.23,7.38 18.83,7.38 18.45,7.76 18.45,8.02
C2CK  (via drill 0.3)
  Top 0.152: IC1.5 13,23.14 12.62,22.76 11.58,22.76 v11.47,22.88 10.58,23.77
  Bottom 0.152: R23.1 v11.47,22.88
  pour Top: 10.2,24.53 10.7,24.53 10.96,24.27 10.96,23.77 10.7,23.51 10.2,23.51 9.94,23.77 9.94,24.27
C2D
  Top 0.152: IC1.6 13.14,22.64 12.86,22.37 10.7,22.37
  pour Top: 10.2,23.13 10.7,23.13 10.96,22.88 10.96,22.37 10.7,22.11 10.2,22.11 9.94,22.37 9.94,22.88
CBOOST  (via drill 0.3)
  Top 0.152: v14.77,15.51 13.93,15.51 13.64,15.8 IC2.14
  Bottom 0.152: v14.77,15.51 14.78,15.52 C16.1
  Bottom 0.305: D3.1 16.32,14.66 15.78,15.19 C16.1
CH
  Top 0.152: IC2.13 13.14,15.87 14.26,14.75 R14.2
CL
  Top 0.152: R15.2 11.47,19.69 11.97,19.19 IC2.9
COUT  (via drill 0.3, 0.4)
  Top 0.152: v12.35,17.03 12.35,17.66 IC2.12
  Route15 0.152: v16.16,9.41 15.78,9.8 15.78,14.24 15.4,14.62 14.39,14.62 12.35,16.65 v12.35,17.03
  Bottom 0.152: R29.2 15.14,17.03 v12.35,17.03
  Bottom 0.305: R29.2 15.53,17.04 15.78,16.79 C16.2
  other vias: 17.18,9.41 27.59,3.45 28.36,4.21
  pour Top (no thermals): 28.48,4.84 28.23,4.84 26.71,3.32 26.71,2.3 27.21,1.79 28.23,1.79 29.75,3.32 29.75,3.57
  pour Top (no thermals): 15.91,10.18 15.91,9.29 16.04,9.16 17.31,9.16 17.43,9.29 17.43,10.18
  pour Bottom (no thermals): 15.28,10.81 17.43,10.81 17.43,9.29 17.31,9.16 16.04,9.16 15.28,9.92
  pour Route15 (rank 2): 15.78,5.6 15.78,9.54 16.04,9.8 17.56,9.8 17.69,9.67 17.69,8.27 18.7,7.26 20.1,7.26 21.5,5.86 28.74,5.86 28.74,3.95 25.56,0.78 20.61,0.78
DVCC  (via drill 0.3, 0.4, 0.75)
  Top 0.152: R4.2 31.65,63.52 30.25,62.12 v30.01,62.12 | U2.55 28.1,60.7 U2.56 | R2.2 C2.1 9.06,38.24 8.8,38.5 8.8,40.49 9.56,41.25 C3.1 | IC9.B1 10.27,35.02 C31.1 11.08,34.81 R42.2 R43.2
  Top 0.203: U2.20 26.29,68.05 v26.83,68.6 | U2.46 v24.29,59.58 | U2.2 29.31,62.12 29.14,62.29 U2.3 | IC1.4 12.61,23.64 v12.23,23.26 12.23,23.52 C4.1 12.09,23.65 10.32,25.42
  Top 0.305: LED3.1 18.71,65.66 v18.7,65.67 v18.7,65.68 | C31.1 v10.57,36.08 v10.58,36.08
  Top 0.508: 29.31,62.12 v30.01,62.12 | 28.1,60.7 28.51,60.7 v29.36,59.84 C12.1
  Route15 0.305: v9.94,42.94 9.94,36.72 v10.58,36.08 11.08,35.58 11.08,28.72 12.35,27.45 12.35,23.38 v12.23,23.26
  Route15 1.016: v9.94,42.94 18.83,51.83 18.83,60.6 | 19.47,61.23 24.04,61.23 24.29,60.98 | 24.29,60.98 24.29,61.23 27.98,61.23 | 24.29,60.98 v24.29,59.58 | v29.36,59.84 27.98,61.23 | v30.01,62.12 29.12,61.23 27.98,61.23 | v18.7,65.68 18.7,65.17 18.83,65.04 18.83,60.6 | v26.83,68.6 19.47,61.23 | 19.47,61.23 18.83,60.6
  Bottom 0.203: v24.29,59.58 C13.1 | v26.83,68.6 26.32,68.09 C11.1 | R22.2 11.85,23.89 12.23,23.51 v12.23,23.26
  pour Top (no thermals): 12.1,40.78 9.18,40.78 9.18,43.6 9.43,43.86 12.1,43.86
  pour Top: 10.2,25.92 10.7,25.92 10.96,25.67 10.96,25.16 10.7,24.91 10.2,24.91 9.94,25.16 9.94,25.67
GND  (via drill 0.3, 0.4)
  Top 0.152: IC9.C3 IC9.B3 10.32,32.84 v10.32,31.51 | IC9.C1 9.87,35.02 C31.2 v9.57,36.08 v9.56,36.08 | BOOT.1 32.97,69.06 v33.18,68.85 33.18,68.67 RST.1 | C10.1 v32.29,64.66
  Top 0.203: IC1.12 15.64,23.14 IC1.21 14.64,24.14 IC1.3 12.73,24.14 12.23,24.65 C4.2 11.85,24.65 v11.59,24.91 11.59,25.67 | LED1.1 24.93,46.5 v25.82,46.5
  Top 0.254: C17.2 11.34,20.47 11.84,20.97 v12.74,20.97 v12.74,20.96 13.11,20.96 IC2.6 | IC2.25 14.41,18.91 v14.41,18.15
  Top 0.305: J1.MP2 24.29,70.3 v25.54,70.3 26.08,70.3 26.23,70.45 J1.A12 | J1.A1 32.12,73.5 v32.8,73.5 J1.MP1 | U2.57 25.69,64.91 v26.32,65.55
  Top 0.508: C12.2 v31.02,60.85
  Route15 0.254: v12.74,20.97 13.5,20.97 v14.41,20.06 15.63,20.06 v16.75,21.18
  Bottom 0.152: v16.75,21.18 16.88,21.05 16.88,20.51 R32.1 | R30.1 14.62,20.06 v14.41,20.06 | v12.74,20.97 13.36,20.34 R18.1 R17.1 R16.1 | v11.59,24.91 C18.2 | R6.2 28.1,74.31 | 28.1,74.31 27.48,74.31 R5.1 | 28.1,74.31 v28.1,74.95
  Bottom 0.305: C11.2 v26.32,65.55 | v24.29,62.75 C13.2 | R30.1 R31.1
  other vias: 11.34,40.02 11.34,39.01 27.09,62.75 15.15,40.78 16.04,40.78 10.45,30.62 12.23,31.51 12.35,30.62 14.13,31.51 14.26,30.62 16.04,31.51 16.16,30.62 28.48,57.55 23.4,57.55 25.94,56.28
  pour Top (rank 5, no thermals): 11.72,40.4 11.72,38.02 11.34,38.02 11.34,38.37 10.83,38.88 9.31,38.88 9.18,39.01 9.18,40.15 9.43,40.4
  pour Bottom (rank 6, no thermals): -5.68,96.03 -21.17,80.53 -21.17,5.22 -5.3,-10.65 87.79,-10.65 99.35,0.91 99.35,84.6 87.92,96.03
  pour Route2 (rank 6, no thermals): -3.65,97.93 -20.92,80.66 -20.92,5.35 -5.04,-10.52 88.05,-10.52 99.6,1.03 99.6,84.73 86.4,97.93
  pour Top: 11.59,26.31 12.1,26.31 12.35,26.05 12.35,25.54 12.1,25.29 11.59,25.29 11.34,25.54 11.34,26.05
  pour Top (no thermals): 15.02,41.04 14.89,40.91 14.89,39.39 15.02,39.26 16.16,39.26 16.29,39.39 16.29,40.91 16.16,41.04
  pour Top (rank 2, no thermals): 8.8,31.64 16.29,31.64 16.42,31.51 16.42,30.5 16.29,30.37 8.8,30.37
  pour Top: 28.1,57.67 28.1,57.42 28.36,57.17 28.61,57.17 28.86,57.42 28.86,57.67 28.61,57.93 28.36,57.93
  pour Top: 25.56,56.4 25.56,56.15 25.82,55.9 26.07,55.9 26.32,56.15 26.32,56.4 26.07,56.66 25.82,56.66
  pour Top: 23.28,57.17 23.53,57.17 23.78,57.42 23.78,57.67 23.53,57.93 23.28,57.93 23.02,57.67 23.02,57.42
IO0
  Top 0.152: U2.5 29.64,63.15 29.88,63.39 29.88,68.91 BOOT.2
IO5
  pour Top: 25.56,57.67 25.56,57.42 25.82,57.17 26.07,57.17 26.32,57.42 26.32,57.67 26.07,57.93 25.82,57.93
IO33_LED_G
  Top 0.152: U2.38 20.63,63.15 20.1,62.63 20.09,62.63 R7.2
IO34_SCL  (via drill 0.3)
  Top 0.152: IC9.A1 11.04,34.06 v11.72,34.06 11.97,34.06 R42.1 | U2.39 21.37,62.75 20.1,61.48 v20.1,60.09
  Route15 0.152: v11.72,34.06 20.1,42.44 v20.1,60.09
IO35_SDA  (via drill 0.3)
  Top 0.152: IC9.A2 10.92,33.29 11.3,32.91 v12.47,32.91 13.24,33.68 R43.1 | v20.74,59.45 20.74,61.48 21.6,62.35 U2.40
  Route15 0.152: v12.47,32.91 12.47,34.04 20.74,42.31 v20.74,59.45
IO36_M_CTRL
  Top 0.152: U2.41 21.84,61.95 21.5,61.61 R19.2
IO37_M_CTRL_OUT  (via drill 0.3)
  Top 0.152: IC1.17 15.64,25.57 16,25.92 v16.42,25.92 | U2.42 22.26,61.53 22.26,57.67 21.76,57.17 R19.1 v21.5,56.15
  Route15 0.152: v21.5,56.15 21.5,42.05 16.67,37.23 16.67,26.18 v16.42,25.92
IO38
  Top 0.152: U2.43 23.09,60.28 22.77,59.96 22.77,56.91 23.4,56.28
  pour Top: 23.28,55.9 23.53,55.9 23.78,56.15 23.78,56.4 23.53,56.66 23.28,56.66 23.02,56.4 23.02,56.15
IO39
  Top 0.152: U2.44 23.49,60.17 23.28,59.96 23.28,58.56 24.04,57.8 24.04,56.91 24.67,56.28
  pour Top: 24.29,56.4 24.29,56.15 24.55,55.9 24.8,55.9 25.05,56.15 25.05,56.4 24.8,56.66 24.55,56.66
IO40
  Top 0.152: U2.45 23.89,60.07 23.66,59.83 23.66,58.56 24.67,57.55
  pour Top: 24.29,57.67 24.29,57.42 24.55,57.17 24.8,57.17 25.05,57.42 25.05,57.67 24.8,57.93 24.55,57.93
IO41
  Top 0.152: U2.47 24.69,60.07 24.85,59.91 24.85,58.64 25.94,57.55
IO42
  Top 0.152: U2.48 25.09,60.2 25.16,60.14 25.16,59.33 26.58,57.9 26.58,56.91 27.21,56.28
  pour Top: 27.09,55.9 27.34,55.9 27.59,56.15 27.59,56.4 27.34,56.66 27.09,56.66 26.83,56.4 26.83,56.15
IO43
  Top 0.152: U2.49 25.49,59.65 27.21,57.93 27.21,57.55
  pour Top: 27.09,57.17 27.34,57.17 27.59,57.42 27.59,57.67 27.34,57.93 27.09,57.93 26.83,57.67 26.83,57.42
IO44
  Top 0.152: U2.50 25.89,59.89 27.85,57.93 27.85,56.91 28.48,56.28
  pour Top: 28.1,56.4 28.1,56.15 28.36,55.9 28.61,55.9 28.86,56.15 28.86,56.4 28.61,56.66 28.36,56.66
IO47_LED_B
  Top 0.152: U2.37 21.59,63.55 21.12,64.02 21.12,64.41 20.74,64.78 R21.1
IO48_LED_R
  Top 0.152: U2.36 21.7,63.95 21.5,64.15 21.5,65.92 20.47,66.95 R20.2
M_AH
  Top 0.152: IC2.22 17,19.19 17.5,19.68 17.5,21.67 17.18,21.99 17.18,23.51 17.05,23.64 IC1.13
M_AL
  Top 0.152: IC1.9 15.14,21.86 15.64,21.37 IC2.1
M_BH
  Top 0.152: IC2.23 16.96,19.69 17.22,19.95 17.22,21.44 16.14,22.52 IC1.11
M_BL
  Top 0.152: IC1.8 14.64,21.86 15.14,21.36 IC2.2
M_CH
  Top 0.152: IC2.24 16.26,20.32 16.26,21.38 15.64,22 IC1.10
M_CL
  Top 0.152: IC1.7 14.14,21.85 14.64,21.36 IC2.3
N$1
  Top 0.152: U2.1 30.84,61.55 36.26,66.97 36.26,69.07 ANT1.1
N$2
  Top 0.152: U1.7 13.11,38.88 12.98,38.76 12.98,37.47 12.74,37.24 R3.2 R2.1 C2.2
N$3
  cutout Bottom (no thermals): 32.67,72.66 32.67,69.87 34.33,68.22 37.25,68.22 39.02,69.99 39.02,76.85 36.87,76.85
N$4
  Top 0.152: R7.1 18.71,62.51 19.21,63.01 19.85,63.01 20.47,63.64 LED3.4
N$6
  cutout Route2 (no thermals): 32.67,72.66 32.67,69.87 34.33,68.22 37.25,68.22 39.02,69.99 39.02,76.85 36.87,76.85
N$21  (via drill 0.3)
  Top 0.152: J1.A5 v29.75,73.42
  Bottom 0.152: v29.75,73.42 v29.75,73.43 R6.1
N$27
  Top 0.203: LED1.2 24.68,47.76 R33.2
N$29
  Top 0.152: R21.2 18.2,63.91 LED3.2
N$31  (via drill 0.3)
  Top 0.152: Q6.3 20.1,6.99 v20.08,7 | R10.1 17.89,14.04 v18.07,13.86
  Route2 0.152: v20.08,7 20.48,7.4 20.48,8.14 19.59,9.03 v19.59,10.56
  Route15 0.152: v19.59,10.56 19.59,11.57 18.07,13.1 v18.07,13.86
N$32  (via drill 0.3)
  Top 0.152: J1.B5 27.42,71.29 27.42,72.48 v27.47,72.53
  Bottom 0.152: v27.47,72.53 R5.2
N$33  (via drill 0.3)
  Top 0.152: R11.1 12.6,15.65 v12.86,15.38
  Route15 0.152: v20.61,8.91 20.1,9.41 20.1,11.58 18.69,12.99 18.69,13.9 15.05,17.54 12.1,17.54 11.85,17.29 11.85,16.4 v12.86,15.38
  Bottom 0.152: R16.2 12.33,17.92 11.89,17.48 11.89,16.74 12.86,15.76 v12.86,15.38 | Q9.3 20.69,8.83 v20.61,8.91
N$34  (via drill 0.3)
  Top 0.152: Q7.3 17.43,8.51 v17.42,8.53 | R12.1 v16.42,13.73
  Route15 0.152: v17.42,8.53 17.82,8.92 17.82,9.8 16.16,11.45 16.16,13.48 v16.42,13.73
N$35  (via drill 0.3)
  Top 0.152: R13.1 11.08,16.65 v10.8,16.36
  Route2 0.152: v16.67,12.08 15.53,13.22 v14.39,13.22
  Route15 0.152: v17.94,10.43 17.94,10.81 v16.67,12.08 | v14.39,13.22 14.39,13.61 13.5,14.49 12.48,14.49 10.8,16.18 v10.8,16.36
  Bottom 0.152: R17.2 12.24,18.94 11.56,18.26 11.56,17.13 v10.8,16.36 | Q10.3 18.02,10.35 v17.94,10.43
N$36  (via drill 0.3)
  Top 0.152: Q8.3 15.1,10.03 14.64,10.49 v14.64,11.07 | R14.1 15.39,14.36 v15.15,14.11
  Route15 0.152: v14.64,11.07 14.64,12.08 15.28,12.72 15.28,13.99 v15.15,14.11
N$37
  Top 0.152: R20.1 19.47,66.82 20.47,65.82 LED3.3
N$38  (via drill 0.3)
  Top 0.152: R15.1 11.08,18.69 11.33,18.94 v11.49,18.94
  Route15 0.152: v15.28,11.95 15.28,10.94 14.89,10.56 14.39,10.56 14.13,10.81 14.13,12.08 14.89,12.84 14.89,13.61 13.62,14.88 12.61,14.88 11.46,16.02 v11.49,18.94
  Bottom 0.152: R18.2 11.49,19.08 v11.49,18.94 | Q11.3 15.35,11.88 v15.28,11.95
N$55
  Bottom 0.152: C18.1 R22.1 R23.2
P_EN
  Top 0.152: U1.6 12.61,38.24 R1.1
RST
  Top 0.152: U2.4 29.76,62.75 R4.1 C10.2 30.65,66.08 RST.2
SENSE_A  (via drill 0.3)
  Top 0.152: IC1.18 15.14,25.92 v15.66,26.43
  Bottom 0.152: R32.2 17.08,19.33 17.65,19.9 17.65,20.71 17.31,21.05 17.31,21.36 R24.2 16.93,21.87 17.37,22.31 17.37,23.33 15.66,25.04 15.66,25.54 v15.66,26.43
  Bottom 0.305: R27.1 17.69,18.68 17.05,19.31 R32.2
SENSE_B  (via drill 0.3)
  Top 0.152: IC1.20 14.14,26.19 v14.39,26.43
  Bottom 0.152: R31.2 16.11,19.33 16.5,19.72 16.5,20.71 15.85,21.36 R25.2 15.78,21.65 15.58,21.85 14.26,21.85 14.13,21.98 14.13,26.18 v14.39,26.43
  Bottom 0.305: R28.1 16.55,18.68 15.91,19.31 R31.2
SENSE_C  (via drill 0.3)
  Top 0.152: v13.62,26.94 13.64,26.92 IC1.1
  Bottom 0.152: R30.2 14.69,19.53 14.18,19.53 13.9,19.8 13.9,20.54 14.73,21.36 R26.2 14.25,21.36 13.75,21.86 13.75,26.81 v13.62,26.94
  Bottom 0.305: R29.1 15.53,18.55 14.89,19.19 R30.2
SENSE_O  (via drill 0.3)
  Top 0.152: IC1.19 14.64,25.93 15.02,26.31 v15.02,26.94
  Bottom 0.152: v15.02,26.94 15.02,22.61 R26.1
  Bottom 0.305: R26.1 R25.1 16.29,22.87 R24.1
USB_D+
  Top 0.152: J1.A6 29.04,72.57 28.89,72.63 28.35,72.45 28.26,72.29 J1.B6 28.67,70.96 28.54,70.67 24.26,68.74 23.89,68.17 U2.26
USB_D-
  Top 0.152: J1.A7 29.15,71.23 28.95,70.43 | U2.25 24.29,68.05 24.49,68.37 28.95,70.43 | J1.B7 30.06,71.58 29.84,70.92 28.95,70.43

### Text on the board
tNames: G 40 41 43 G / 38 39 G 42 44 | - + | + - | GND | EFM8BB21F16G | D CK VCC | Designed by JX Wang | @SwarmLab | FD6288Q
bNames: JLCJLCJLCJLC | Spinon_Test_Platform_2.1 | 2025.May.23